# EAGLE design display (EAGLE 7.6.0)
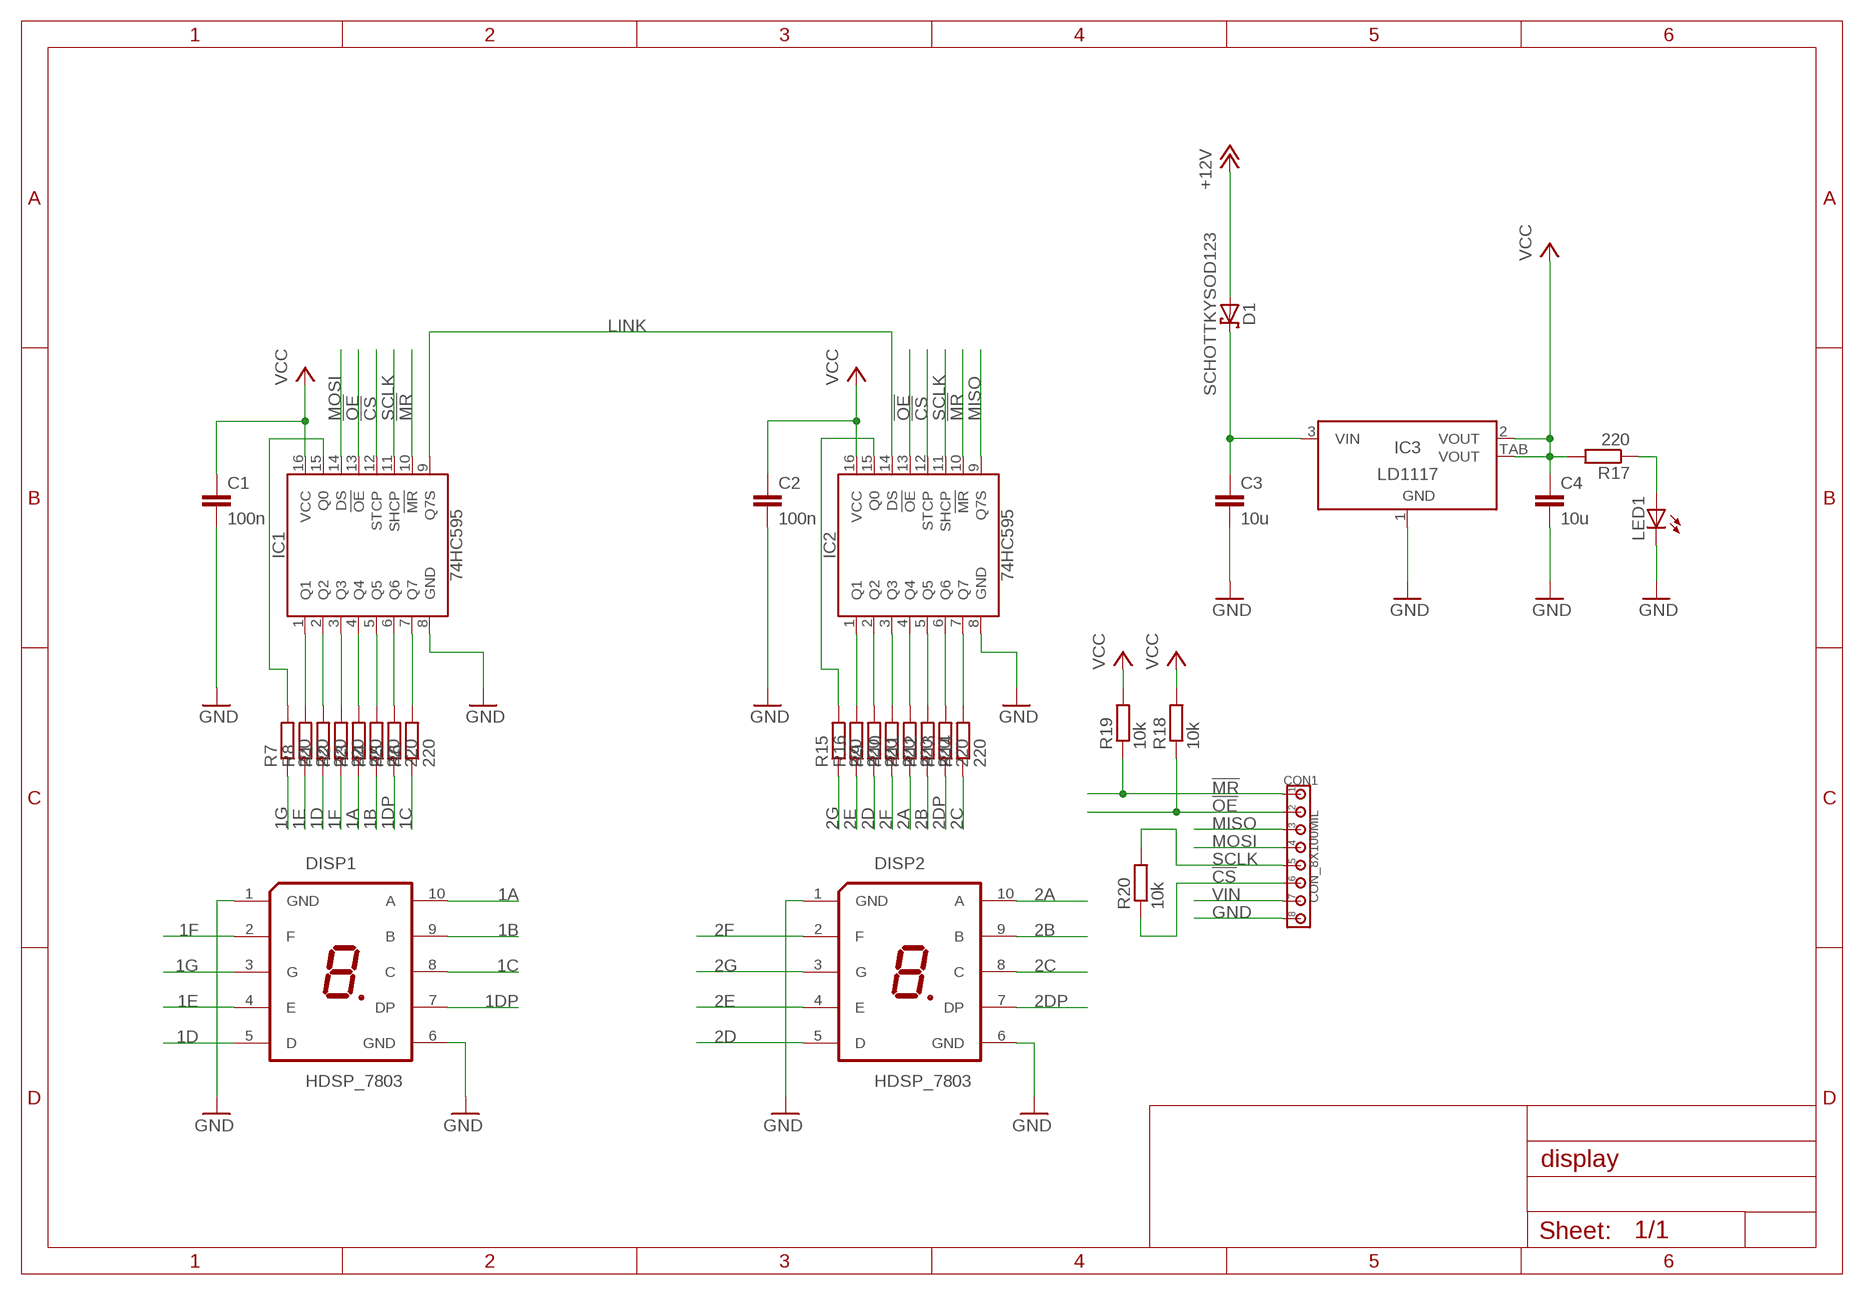
[diagram p0: schematic, sheet 1]

## Parts
C1  100n  CC1206  [C1206]
C2  100n  CC1206  [C1206]
C3  10u  CC1206  [C1206]
C4  10u  CC1206  [C1206]
CON1  CON_8X100MIL  [100MIL_8X]
D1  SCHOTTKYSOD123  [SOD123]
DISP1  HDSP_7803  [HDSP-A]
DISP2  HDSP_7803  [HDSP-A]
IC1  74HC595  [SO16]
IC2  74HC595  [SO16]
IC3  LD1117  [SOT223]
LED1  LED1206  [LED1206]
R1  220  RESISTORR1206  [R1206]
R2  220  RESISTORR1206  [R1206]
R3  220  RESISTORR1206  [R1206]
R4  220  RESISTORR1206  [R1206]
R5  220  RESISTORR1206  [R1206]
R6  220  RESISTORR1206  [R1206]
R7  220  RESISTORR1206  [R1206]
R8  220  RESISTORR1206  [R1206]
R9  220  RESISTORR1206  [R1206]
R10  220  RESISTORR1206  [R1206]
R11  220  RESISTORR1206  [R1206]
R12  220  RESISTORR1206  [R1206]
R13  220  RESISTORR1206  [R1206]
R14  220  RESISTORR1206  [R1206]
R15  220  RESISTORR1206  [R1206]
R16  220  RESISTORR1206  [R1206]
R17  220  RESISTORR1206  [R1206]
R18  10k  RESISTORR1206  [R1206]
R19  10k  RESISTORR1206  [R1206]
R20  10k  RESISTORR1206  [R1206]

## Nets
1A: DISP1.10(A) R3.1
1B: DISP1.9(B) R4.1
1C: DISP1.8(C) R6.1
1D: DISP1.5(D) R1.1
1DP: DISP1.7(DP) R5.1
1E: DISP1.4(E) R8.1
1F: DISP1.2(F) R2.1
1G: DISP1.3(G) R7.1
2A: DISP2.10(A) R11.1
2B: DISP2.9(B) R12.1
2C: DISP2.8(C) R14.1
2D: DISP2.5(D) R9.1
2DP: DISP2.7(DP) R13.1
2E: DISP2.4(E) R16.1
2F: DISP2.2(F) R10.1
2G: DISP2.3(G) R15.1
!CS!: CON1.6 IC1.12(STCP) IC2.12(STCP) R20.1
!MR!: CON1.1 IC1.10(!MR!) IC2.10(!MR!) R19.1
!OE!: CON1.2 IC1.13(!OE!) IC2.13(!OE!) R18.1
GND: C1.2 C2.2 C3.2 C4.2 CON1.8 DISP1.1(GND) DISP1.6(GND) DISP2.1(GND) DISP2.6(GND) IC1.8(GND) IC2.8(GND) IC3.1(GND) LED1.C
LINK: IC1.9(Q7S) IC2.14(DS)
MISO: CON1.3 IC2.9(Q7S)
MOSI: CON1.4 IC1.14(DS)
N$9: IC1.15(Q0) R7.2
N$10: IC1.7(Q7) R6.2
N$11: IC1.6(Q6) R5.2
N$12: IC1.5(Q5) R4.2
N$13: IC1.4(Q4) R3.2
N$14: IC1.3(Q3) R2.2
N$15: IC1.2(Q2) R1.2
N$16: IC1.1(Q1) R8.2
N$17: IC2.15(Q0) R15.2
N$18: IC2.7(Q7) R14.2
N$19: IC2.6(Q6) R13.2
N$20: IC2.5(Q5) R12.2
N$21: IC2.4(Q4) R11.2
N$22: IC2.3(Q3) R10.2
N$23: IC2.2(Q2) R9.2
N$24: IC2.1(Q1) R16.2
N$34: C3.1 D1.C IC3.3(VIN)
N$35: LED1.A R17.1
SCLK: CON1.5 IC1.11(SHCP) IC2.11(SHCP) R20.2
VCC: C1.1 C2.1 C4.1 IC1.16(VCC) IC2.16(VCC) IC3.2(VOUT) IC3.TAB(VOUT) R17.2 R18.2 R19.2
VIN: CON1.7 D1.A ; supply symbol labelled +12V

## Library data of the parts
C1-C4 = 00Capacitor:C: Capacitor
CON1 = 00Connector:CON_8X: 8-pin header
D1 = 00Diode:SCHOTTKY
DISP1 DISP2 = 00Display:HDSP_7803
IC1 IC2 = 00Logic:74HC595
IC3 = 00VoltageRegulator:LD1117: Positive Voltage Regulator 800mA
LED1 = 00Display:LED: LED
R1-R20 = 00Resistor:RESISTOR: RESISTOR, European symbol

## Board
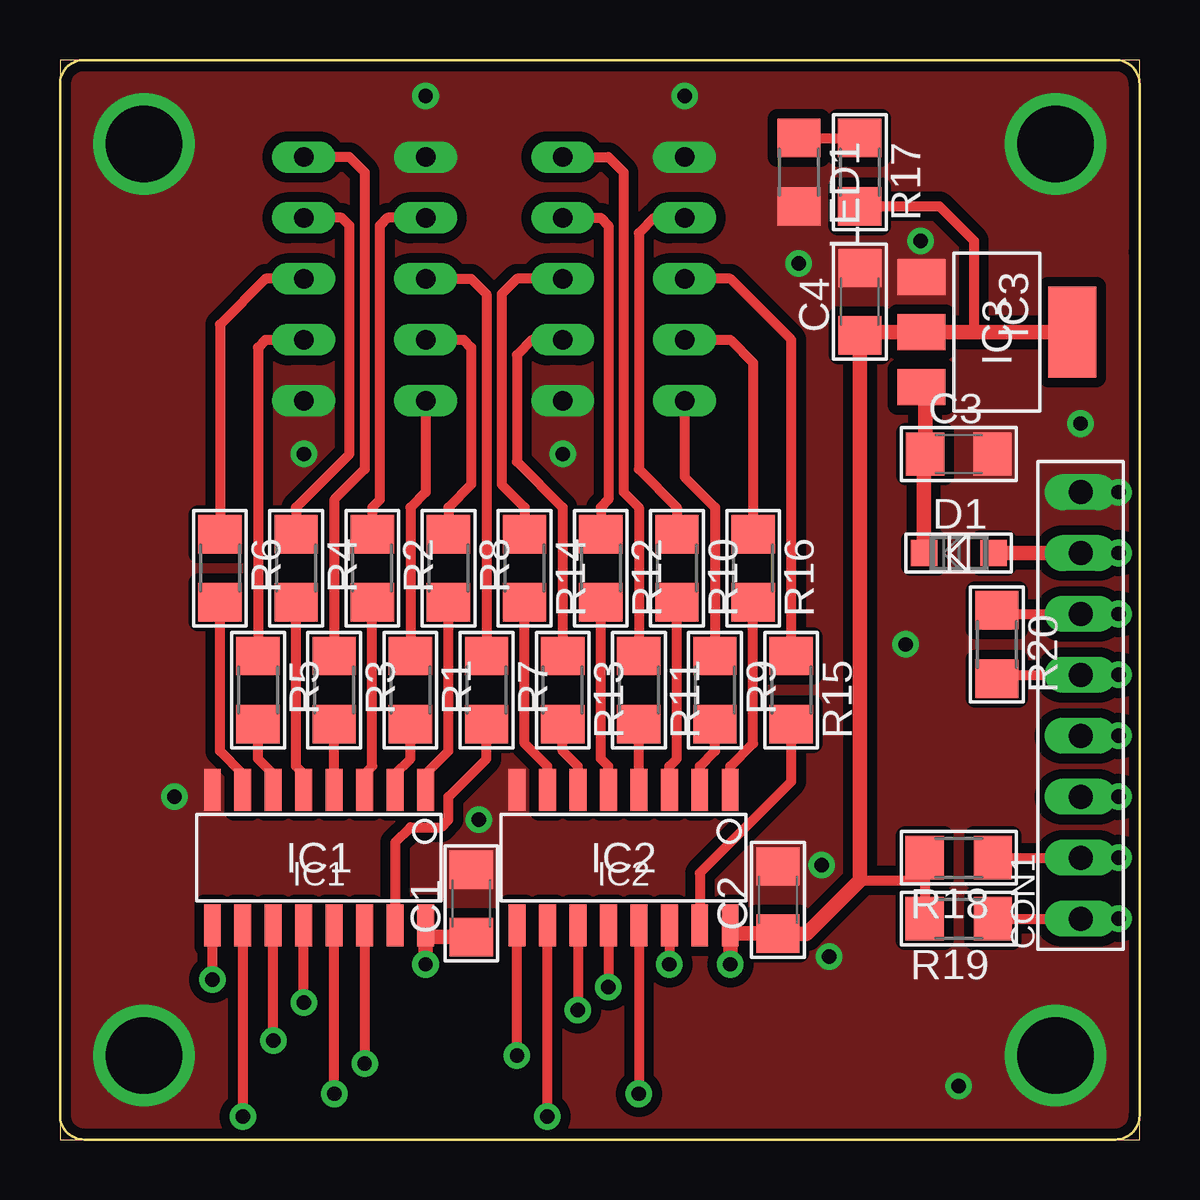
[diagram p1: board, top side]
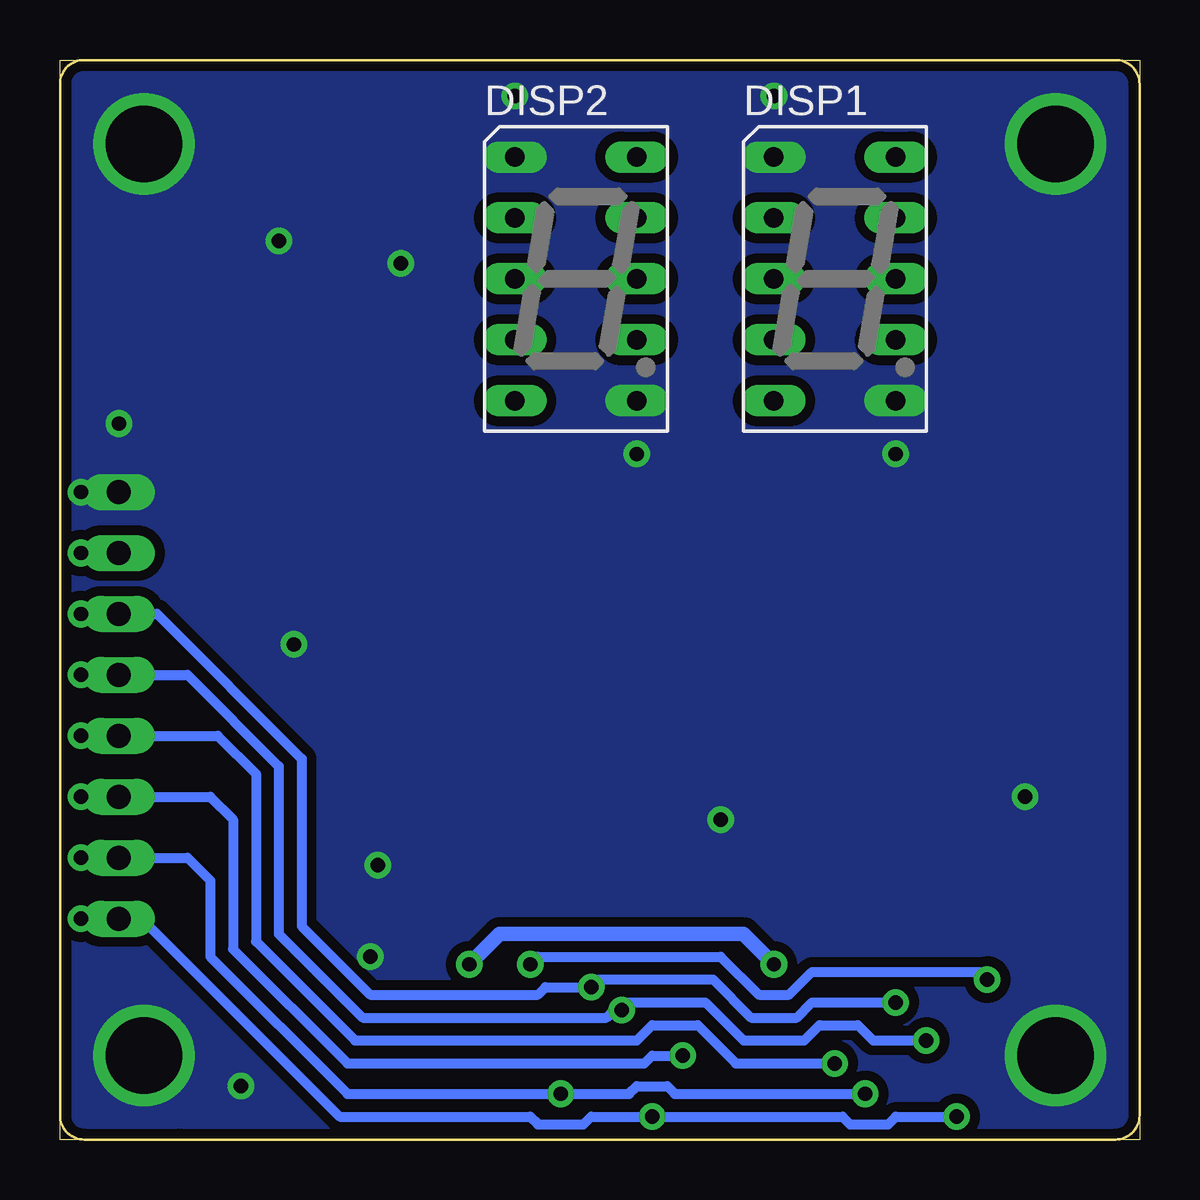
[diagram p2: board, bottom side, seen from below]

Size 45 x 45 mm. Coordinates in mm from the lower left corner, seen from the top.
Outline: 40,0 0,0 0,29
Outline: 40,0 45,0 45,37
Outline: 45,37 45,45 3,45
Outline: 3,45 0,45 0,29
Outline: 0,29 0,44 arc-90 1,45 3,45
Outline: 3,45 44,45 arc-90 45,44 45,37
Outline: 45,37 45,1 arc-90 44,0 40,0
Outline: 40,0 1,0 arc-90 0,1 0,29
Copper layers (1*16): Top 0.035mm / dielectric 1.5mm / Bottom 0.035mm
Design rules "LPKF_Compatible": minimum track width 8mil, minimum drill 23mil, track to track 8mil, track to pad 8mil, pad to pad 8mil, via to via 8mil, smd to smd 0mil, copper to edge 10mil, drill to drill 10mil, minimum pad ring 10mil, minimum via ring 10mil, stop-mask expansion 2mil, vias tented up to drill 25mil, thermal gap 10mil

### Footprints (pad centres in the part's own frame; a part is rotated, then mirrored left to right if it is on the bottom)
C1206 = smd 1.6 x 1.8: 1 -1.4,0; 2 1.4,0
100MIL_8X = drill 1 long: 1 -8.89,0; 2 -6.35,0; 3 -3.81,0; 4 -1.27,0; 5 1.27,0; 6 3.81,0; 7 6.35,0; 8 8.89,0
SOD123 = smd 1.1 x 1.1: A 1.45,0; C -1.45,0
HDSP-A = drill 0.813 long: 1 -2.54,5.08; 2 -2.54,2.54; 3 -2.54,0; 4 -2.54,-2.54; 5 -2.54,-5.08; 6 2.54,-5.08; 7 2.54,-2.54; 8 2.54,0; 9 2.54,2.54; 10 2.54,5.08
SO16 = smd 0.7 x 1.75: 1 -4.445,-2.825; 2 -3.175,-2.825; 3 -1.905,-2.825; 4 -0.635,-2.825; 5 0.635,-2.825; 6 1.905,-2.825; 7 3.175,-2.825; 8 4.445,-2.825; 9 4.445,2.825; 10 3.175,2.825; 11 1.905,2.825; 12 0.635,2.825; 13 -0.635,2.825; 14 -1.905,2.825; 15 -3.175,2.825; 16 -4.445,2.825
SOT223 = smd 1.5 x 2: 1 -2.3,-3.15; 2 0,-3.15; 3 2.3,-3.15 | smd 3.8 x 2: TAB 0,3.15
LED1206 = smd 1.6 x 1.803: A -1.422,0; C 1.422,0
R1206 = smd 1.6 x 1.803: 1 -1.422,0; 2 1.422,0

### Placement (x,y rotation side)
C1  17.14,9.84 90 top
C2  29.93,9.99 90 top
C3  37.47,28.57 0 top
C4  33.34,34.92 90 top
CON1  42.55,18.1 90 top
D1  37.47,24.45 0 top
DISP1  12.7,35.88 0 bottom
DISP2  23.5,35.88 0 bottom
IC1  10.79,11.75 180 top
IC2  23.5,11.75 180 top
IC3  39.05,33.66 270 top
LED1  30.8,40.32 270 top
R1  14.61,18.73 270 top
R2  13.02,23.81 270 top
R3  11.43,18.73 270 top
R4  9.84,23.81 270 top
R5  8.26,18.73 270 top
R6  6.67,23.81 270 top
R7  17.78,18.73 270 top
R8  16.19,23.81 270 top
R9  27.3,18.73 270 top
R10  25.72,23.81 270 top
R11  24.13,18.73 270 top
R12  22.54,23.81 270 top
R13  20.95,18.73 270 top
R14  19.37,23.81 270 top
R15  30.48,18.73 270 top
R16  28.89,23.81 270 top
R17  33.34,40.32 270 top
R18  37.47,11.75 180 top
R19  37.47,9.21 180 top
R20  39.05,20.64 270 top

### Tracks (layer width: path | path; a pad name or v marks a point on that pad's centre or on a via)
1A
  Top 0.406: DISP1.10 12.06,40.96 12.7,40.32 12.7,27.94 11.43,26.67 R3.1
1B
  Top 0.406: DISP1.9 11.75,38.42 12.06,38.1 12.06,28.57 9.84,26.35 R4.1
1C
  Top 0.406: DISP1.8 8.57,35.88 6.67,33.97 R6.1
1D
  Top 0.406: DISP1.5 15.24,26.99 14.61,26.35 R1.1
1DP
  Top 0.406: DISP1.7 8.57,33.34 8.26,33.02 R5.1
1E
  Top 0.406: DISP1.4 16.83,33.34 17.14,33.02 17.14,27.3 16.19,26.35 R8.1
1F
  Top 0.406: DISP1.2 13.65,38.42 13.34,38.1 13.34,26.67 13.02,26.35 R2.1
1G
  Top 0.406: DISP1.3 17.14,35.88 17.78,35.24 R7.1
2A
  Top 0.406: DISP2.10 22.86,40.96 23.5,40.32 23.5,26.99 24.13,26.35 R11.1
2B
  Top 0.406: DISP2.9 22.54,38.42 22.86,38.1 22.86,26.67 22.54,26.35 R12.1
2C
  Top 0.406: DISP2.8 19.05,35.88 18.41,35.24 18.41,27.3 19.37,26.35 R14.1
2D
  Top 0.406: DISP2.5 26.04,27.62 27.3,26.35 R9.1
2DP
  Top 0.406: DISP2.7 19.68,33.34 19.05,32.7 19.05,28.26 20.95,26.35 R13.1
2E
  Top 0.406: DISP2.4 27.94,33.34 28.89,32.38 R16.1
2F
  Top 0.406: DISP2.2 24.77,38.42 24.13,37.78 24.13,27.94 25.72,26.35 R10.1
2G
  Top 0.406: R15.1 30.48,33.34 27.94,35.88 DISP2.3
!CS!  (via drill 0.6)
  Top 0.406: v10.16,5.71 IC1.12 | R20.1 39.2,21.91 CON1.6 | IC2.12 v22.86,6.35
  Top 0.61: CON1.6 v44.13,21.91
  Bottom 0.406: CON1.6 40.96,21.91 34.92,15.88 34.92,8.89 32.07,6.03 25.08,6.03 24.77,6.35 v22.86,6.35 22.54,6.67 17.78,6.67 16.19,5.08 14.29,5.08 13.65,5.71 v10.16,5.71
  Bottom 0.61: v44.13,21.91 CON1.6
!MR!  (via drill 0.6)
  Top 0.406: v20.32,0.95 IC2.10 | IC1.10 v7.62,0.95 | R19.1 CON1.1
  Top 0.61: CON1.1 v44.13,9.21
  Bottom 0.406: CON1.1 41.59,9.21 33.34,0.95 25.4,0.95 25.08,0.64 23.18,0.64 22.86,0.95 v20.32,0.95 12.38,0.95 12.06,0.64 10.48,0.64 10.16,0.95 v7.62,0.95
  Bottom 0.61: v44.13,9.21 CON1.1
!OE!  (via drill 0.6)
  Top 0.406: v11.43,1.91 IC1.13 | IC2.13 v24.13,1.91 | R18.1 CON1.2
  Top 0.61: CON1.2 v44.13,11.75
  Bottom 0.406: CON1.2 39.69,11.75 38.73,10.79 38.73,7.62 33.02,1.91 v24.13,1.91 21.27,1.91 20.95,2.22 19.68,2.22 19.37,1.91 v11.43,1.91
  Bottom 0.61: v44.13,11.75 CON1.2
GND  (via drill 0.6, 3.2)
  other vias: 3.5,41.5 41.5,41.5 41.5,3.5 3.5,3.5 10.16,28.57 20.95,28.57 4.76,14.29 17.46,13.34 44.13,26.99 35.24,20.64 37.47,2.22 31.75,11.43 32.07,7.62 35.88,37.47 30.8,36.51 15.24,43.5 26.04,43.5 42.55,29.84
  pour Bottom (isolate 0.406, no thermals): 0,1 0,44 arc-90 1,45 44,45 arc-90 45,44 45,1 arc-90 44,0 1,0 arc-90
  pour Top (isolate 0.406, no thermals): 0,1 0,44 arc-90 1,45 44,45 arc-90 45,44 45,1 arc-90 44,0 1,0 arc-90
LINK  (via drill 0.6)
  Top 0.406: IC2.14 v25.4,7.3 | IC1.9 v6.35,6.67
  Bottom 0.406: v25.4,7.3 25.08,7.62 17.46,7.62 15.88,6.03 14.61,6.03 13.65,6.99 6.67,6.99 v6.35,6.67
MISO  (via drill 0.6)
  Top 0.406: v19.05,3.49 IC2.9
  Top 0.61: CON1.3 v44.13,14.29
  Bottom 0.406: CON1.3 38.73,14.29 37.78,13.34 37.78,7.94 33.02,3.17 20.64,3.17 20.32,3.49 v19.05,3.49
  Bottom 0.61: v44.13,14.29 CON1.3
MOSI  (via drill 0.6)
  Top 0.406: IC1.14 v12.7,3.17
  Top 0.61: CON1.4 v44.13,16.83
  Bottom 0.406: CON1.4 38.42,16.83 36.83,15.24 36.83,8.26 32.7,4.13 20.95,4.13 20.32,4.76 18.41,4.76 16.83,3.17 v12.7,3.17
  Bottom 0.61: v44.13,16.83 CON1.4
N$9
  Top 0.406: R7.2 17.78,15.88 16.19,14.29 16.19,13.34 15.88,13.02 14.61,13.02 13.97,12.38 IC1.15
N$10
  Top 0.406: IC1.7 7.62,15.24 6.67,16.19 R6.2
N$11
  Top 0.406: IC1.6 8.89,15.24 8.26,15.88 R5.2
N$12
  Top 0.406: IC1.5 10.16,15.24 9.84,15.56 R4.2
N$13
  Top 0.406: IC1.4 R3.2
N$14
  Top 0.406: IC1.3 12.7,15.24 13.02,15.56 R2.2
N$15
  Top 0.406: IC1.2 13.97,15.24 14.61,15.88 R1.2
N$16
  Top 0.406: IC1.1 15.24,15.24 16.19,16.19 R8.2
N$17
  Top 0.406: R15.2 30.48,14.92 26.67,11.11 IC2.15
N$18
  Top 0.406: IC2.7 20.32,15.56 19.37,16.51 R14.2
N$19
  Top 0.406: IC2.6 21.59,15.56 20.95,16.19 R13.2
N$20
  Top 0.406: IC2.5 22.86,15.56 22.54,15.88 R12.2
N$21
  Top 0.406: IC2.4 R11.2
N$22
  Top 0.406: IC2.3 25.4,15.56 25.72,15.88 R10.2
N$23
  Top 0.406: IC2.2 26.67,15.56 27.3,16.19 R9.2
N$24
  Top 0.406: IC2.1 27.94,15.56 28.89,16.51 R16.2
N$34
  Top 0.61: 35.88,28.39 C3.1 | D1.C 36.02,28.52 C3.1 | C3.1 36.06,31.19 IC3.3
N$35
  Top 0.406: LED1.A R17.1
SCLK  (via drill 0.6)
  Top 0.406: v8.89,4.13 IC1.11 | R20.2 39.2,19.37 CON1.5 | IC2.11 v21.59,5.4
  Top 0.61: v44.13,19.37 CON1.5
  Bottom 0.406: CON1.5 39.69,19.37 35.88,15.56 35.88,8.57 32.38,5.08 22.23,5.08 21.91,5.4 v21.59,5.4 21.27,5.71 18.1,5.71 16.51,4.13 13.97,4.13 13.34,4.76 11.75,4.76 11.11,4.13 v8.89,4.13
  Bottom 0.61: v44.13,19.37 CON1.5
VCC  (via drill 0.6)
  Top 0.406: R17.2 36.66,38.9 38.1,37.47 38.1,33.66 | R18.2 36.04,10.79 | 36.04,10.79 R19.2 | 33.34,10.79 36.04,10.79
  Top 0.61: IC3.TAB 38.1,33.66 IC3.2 33.47,33.66 C4.1 33.34,10.79 31.11,8.57 29.95,8.57 C2.1 28.27,8.59 IC2.16 v27.94,7.3 | IC1.16 15.24,8.26 | 15.24,8.26 v15.24,7.3 | C1.1 15.43,8.44 15.24,8.26
  Bottom 0.61: v27.94,7.3 26.67,8.57 16.51,8.57 v15.24,7.3
VIN  (via drill 0.6)
  Top 0.61: D1.A CON1.7 v44.13,24.45
  Bottom 0.61: v44.13,24.45 CON1.7